# Altium schematic sheet Schematic_Buttons_Luximetro.SchDoc
size A4
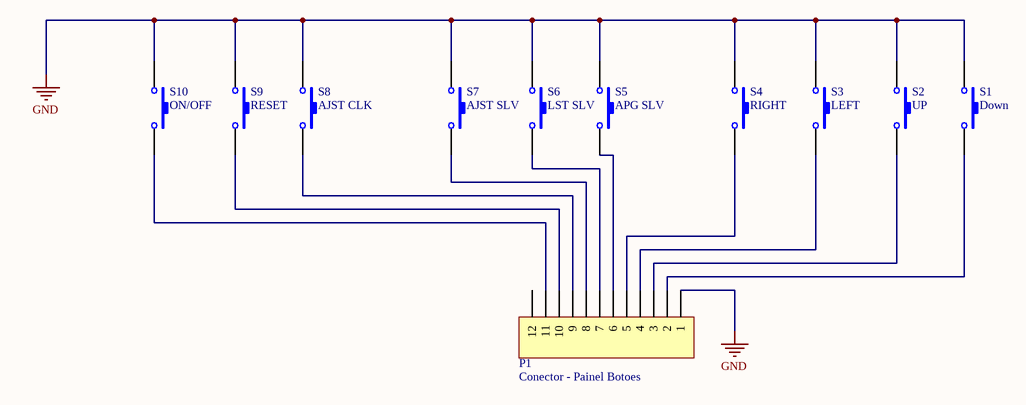
[diagram p0: Schematic_Buttons_Luximetro.SchDoc]

## Parts
P1  Conector - Painel Botoes  [HDR1X12]
S1  Down  [SPST-2]
S2  UP  [SPST-2]
S3  LEFT  [SPST-2]
S4  RIGHT  [SPST-2]
S5  APG SLV  [SPST-2]
S6  LST SLV  [SPST-2]
S7  AJST SLV  [SPST-2]
S8  AJST CLK  [SPST-2]
S9  RESET  [SPST-2]
S10  ON/OFF  [SPST-2]

## Nets
GND: P1.1 S1.1 S2.1 S3.1 S4.1 S5.1 S6.1 S7.1 S8.1 S9.1 S10.1
NetP1_2: P1.2 S1.2
NetP1_3: P1.3 S2.2
NetP1_4: P1.4 S3.2
NetP1_5: P1.5 S4.2
NetP1_6: P1.6 S5.2
NetP1_7: P1.7 S6.2
NetP1_8: P1.8 S7.2
NetP1_9: P1.9 S8.2
NetP1_10: P1.10 S9.2
NetP1_11: P1.11 S10.2

Not connected (* = marked no-connect by the designer): P1 12

## Library data of the parts
P1 = Header 12: Header, 12-Pin; LatestRevisionDate: 17-Jul-2002; LatestRevisionNote: Re-released for DXP Platform.; Publisher: Altium Limited
S1-S10 = SW-PB: Switch; Published: 24-Mar-1999; LatestRevisionDate: 17-Jul-2002; LatestRevisionNote: Re-released for DXP Platform.; PackageReference: SPST-2; Publisher: Altium Limited